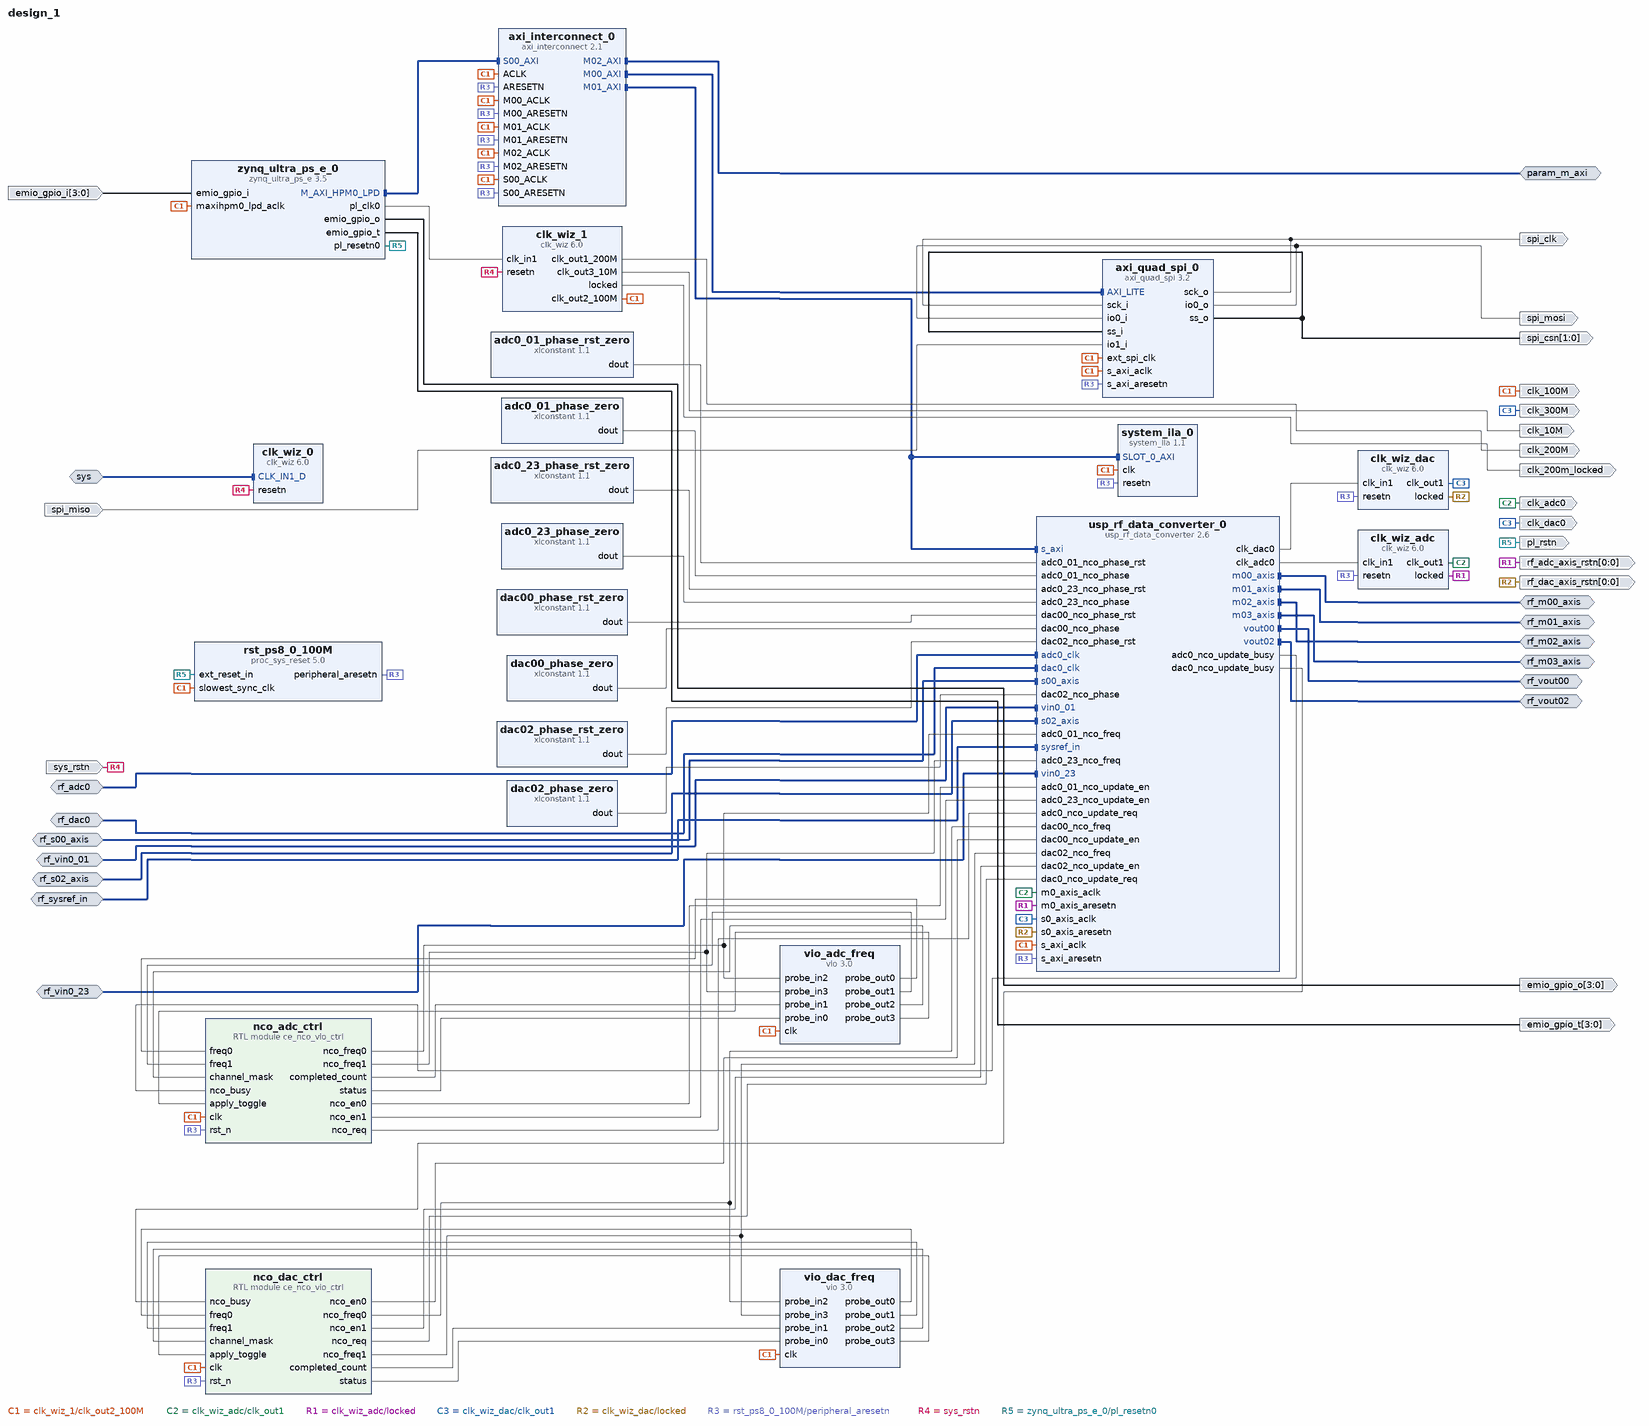
[diagram p0: block diagram of the top level]
# Vivado block design design_1, xczu47dr-ffve1156-2-i, Vivado 2023.2
create_bd_design design_1

create_bd_intf_port -mode Slave -vlnv xilinx.com:interface:diff_clock_rtl:1.0 sys
set_property -dict {CONFIG.FREQ_HZ 200000000} [get_bd_intf_ports sys]
create_bd_intf_port -mode Slave -vlnv xilinx.com:interface:diff_clock_rtl:1.0 rf_adc0
create_bd_intf_port -mode Slave -vlnv xilinx.com:interface:diff_analog_io_rtl:1.0 rf_vin0_01
create_bd_intf_port -mode Slave -vlnv xilinx.com:interface:diff_clock_rtl:1.0 rf_dac0
create_bd_intf_port -mode Slave -vlnv xilinx.com:display_usp_rf_data_converter:diff_pins_rtl:1.0 rf_sysref_in
create_bd_intf_port -mode Master -vlnv xilinx.com:interface:diff_analog_io_rtl:1.0 rf_vout00
create_bd_intf_port -mode Slave -vlnv xilinx.com:interface:axis_rtl:1.0 rf_s00_axis
set_property -dict [list \
  CONFIG.HAS_TKEEP 0 \
  CONFIG.HAS_TLAST 0 \
  CONFIG.HAS_TREADY 1 \
  CONFIG.HAS_TSTRB 0 \
  CONFIG.LAYERED_METADATA undef \
  CONFIG.TDATA_NUM_BYTES 32 \
  CONFIG.TDEST_WIDTH 0 \
  CONFIG.TID_WIDTH 0 \
  CONFIG.TUSER_WIDTH 0 \
] [get_bd_intf_ports rf_s00_axis]
create_bd_intf_port -mode Master -vlnv xilinx.com:interface:axis_rtl:1.0 rf_m00_axis
create_bd_intf_port -mode Master -vlnv xilinx.com:interface:axis_rtl:1.0 rf_m01_axis
create_bd_intf_port -mode Master -vlnv xilinx.com:interface:aximm_rtl:1.0 param_m_axi
set_property -dict [list \
  CONFIG.ADDR_WIDTH 40 \
  CONFIG.DATA_WIDTH 32 \
  CONFIG.HAS_REGION 0 \
  CONFIG.NUM_READ_OUTSTANDING 8 \
  CONFIG.NUM_WRITE_OUTSTANDING 8 \
  CONFIG.PROTOCOL AXI4LITE \
] [get_bd_intf_ports param_m_axi]
create_bd_intf_port -mode Master -vlnv xilinx.com:interface:diff_analog_io_rtl:1.0 rf_vout02
create_bd_intf_port -mode Slave -vlnv xilinx.com:interface:axis_rtl:1.0 rf_s02_axis
set_property -dict [list \
  CONFIG.HAS_TKEEP 0 \
  CONFIG.HAS_TLAST 0 \
  CONFIG.HAS_TREADY 1 \
  CONFIG.HAS_TSTRB 0 \
  CONFIG.LAYERED_METADATA undef \
  CONFIG.TDATA_NUM_BYTES 32 \
  CONFIG.TDEST_WIDTH 0 \
  CONFIG.TID_WIDTH 0 \
  CONFIG.TUSER_WIDTH 0 \
] [get_bd_intf_ports rf_s02_axis]
create_bd_intf_port -mode Master -vlnv xilinx.com:interface:axis_rtl:1.0 rf_m02_axis
create_bd_intf_port -mode Master -vlnv xilinx.com:interface:axis_rtl:1.0 rf_m03_axis
create_bd_intf_port -mode Slave -vlnv xilinx.com:interface:diff_analog_io_rtl:1.0 rf_vin0_23
create_bd_port -dir I -from 3 -to 0 emio_gpio_i
create_bd_port -dir O -from 3 -to 0 emio_gpio_o
create_bd_port -dir O -from 3 -to 0 emio_gpio_t
create_bd_port -dir I -type rst sys_rstn
create_bd_port -dir O -from 0 -to 0 -type rst rf_adc_axis_rstn
create_bd_port -dir O -from 0 -to 0 -type rst rf_dac_axis_rstn
create_bd_port -dir O -type clk clk_adc0
set_property -dict {CONFIG.ASSOCIATED_BUSIF rf_m01_axis:rf_m00_axis:rf_m02_axis:rf_m03_axis} [get_bd_ports clk_adc0]
create_bd_port -dir O -type clk clk_dac0
set_property -dict {CONFIG.ASSOCIATED_BUSIF rf_s00_axis:rf_s02_axis} [get_bd_ports clk_dac0]
create_bd_port -dir O -type clk clk_200M
create_bd_port -dir O -type clk clk_300M
set_property -dict {CONFIG.FREQ_HZ 300000000} [get_bd_ports clk_300M]
create_bd_port -dir O -type clk clk_100M
set_property -dict {CONFIG.ASSOCIATED_BUSIF param_m_axi CONFIG.ASSOCIATED_RESET clk_100M_rstn} [get_bd_ports clk_100M]
create_bd_port -dir O -type rst pl_rstn
create_bd_port -dir O -from 1 -to 0 spi_csn
create_bd_port -dir O spi_clk
create_bd_port -dir O spi_mosi
create_bd_port -dir I spi_miso
create_bd_port -dir O -type clk clk_10M
create_bd_port -dir O -type rst clk_200m_locked
set_property -dict {CONFIG.POLARITY ACTIVE_HIGH} [get_bd_ports clk_200m_locked]

create_bd_cell -type ip -vlnv xilinx.com:ip:zynq_ultra_ps_e:3.5 zynq_ultra_ps_e_0
set_property -dict [list \
  CONFIG.CAN0_BOARD_INTERFACE custom \
  CONFIG.CAN1_BOARD_INTERFACE custom \
  CONFIG.CSU_BOARD_INTERFACE custom \
  CONFIG.DP_BOARD_INTERFACE custom \
  CONFIG.GEM0_BOARD_INTERFACE custom \
  CONFIG.GEM1_BOARD_INTERFACE custom \
  CONFIG.GEM2_BOARD_INTERFACE custom \
  CONFIG.GEM3_BOARD_INTERFACE custom \
  CONFIG.GPIO_BOARD_INTERFACE custom \
  CONFIG.IIC0_BOARD_INTERFACE custom \
  CONFIG.IIC1_BOARD_INTERFACE custom \
  CONFIG.NAND_BOARD_INTERFACE custom \
  CONFIG.PCIE_BOARD_INTERFACE custom \
  CONFIG.PJTAG_BOARD_INTERFACE custom \
  CONFIG.PMU_BOARD_INTERFACE custom \
  CONFIG.PSU_BANK_0_IO_STANDARD LVCMOS18 \
  CONFIG.PSU_BANK_1_IO_STANDARD LVCMOS18 \
  CONFIG.PSU_BANK_2_IO_STANDARD LVCMOS18 \
  CONFIG.PSU_BANK_3_IO_STANDARD LVCMOS33 \
  CONFIG.PSU_USB3__DUAL_CLOCK_ENABLE 1 \
  CONFIG.PSU__CAN1__PERIPHERAL__ENABLE 0 \
  CONFIG.PSU__CRF_APB__ACPU_CTRL__FREQMHZ 1333.333 \
  CONFIG.PSU__CRF_APB__ACPU_CTRL__SRCSEL APLL \
  CONFIG.PSU__CRF_APB__APLL_CTRL__SRCSEL PSS_REF_CLK \
  CONFIG.PSU__CRF_APB__DBG_FPD_CTRL__FREQMHZ 250 \
  CONFIG.PSU__CRF_APB__DBG_FPD_CTRL__SRCSEL IOPLL \
  CONFIG.PSU__CRF_APB__DBG_TRACE_CTRL__FREQMHZ 250 \
  CONFIG.PSU__CRF_APB__DBG_TRACE_CTRL__SRCSEL IOPLL \
  CONFIG.PSU__CRF_APB__DBG_TSTMP_CTRL__FREQMHZ 250 \
  CONFIG.PSU__CRF_APB__DBG_TSTMP_CTRL__SRCSEL IOPLL \
  CONFIG.PSU__CRF_APB__DDR_CTRL__FREQMHZ 1200 \
  CONFIG.PSU__CRF_APB__DDR_CTRL__SRCSEL DPLL \
  CONFIG.PSU__CRF_APB__DPDMA_REF_CTRL__FREQMHZ 600 \
  CONFIG.PSU__CRF_APB__DPDMA_REF_CTRL__SRCSEL APLL \
  CONFIG.PSU__CRF_APB__DPLL_CTRL__SRCSEL PSS_REF_CLK \
  CONFIG.PSU__CRF_APB__DP_AUDIO_REF_CTRL__SRCSEL VPLL \
  CONFIG.PSU__CRF_APB__DP_STC_REF_CTRL__SRCSEL VPLL \
  CONFIG.PSU__CRF_APB__DP_VIDEO_REF_CTRL__SRCSEL VPLL \
  CONFIG.PSU__CRF_APB__GDMA_REF_CTRL__FREQMHZ 600 \
  CONFIG.PSU__CRF_APB__GDMA_REF_CTRL__SRCSEL APLL \
  CONFIG.PSU__CRF_APB__GPU_REF_CTRL__FREQMHZ 600 \
  CONFIG.PSU__CRF_APB__GPU_REF_CTRL__SRCSEL DPLL \
  CONFIG.PSU__CRF_APB__TOPSW_LSBUS_CTRL__FREQMHZ 100 \
  CONFIG.PSU__CRF_APB__TOPSW_LSBUS_CTRL__SRCSEL IOPLL \
  CONFIG.PSU__CRF_APB__TOPSW_MAIN_CTRL__FREQMHZ 533.333 \
  CONFIG.PSU__CRF_APB__TOPSW_MAIN_CTRL__SRCSEL DPLL \
  CONFIG.PSU__CRF_APB__VPLL_CTRL__SRCSEL PSS_REF_CLK \
  CONFIG.PSU__CRL_APB__ADMA_REF_CTRL__FREQMHZ 533.333 \
  CONFIG.PSU__CRL_APB__ADMA_REF_CTRL__SRCSEL IOPLL \
  CONFIG.PSU__CRL_APB__CAN1_REF_CTRL__FREQMHZ 100 \
  CONFIG.PSU__CRL_APB__CAN1_REF_CTRL__SRCSEL IOPLL \
  CONFIG.PSU__CRL_APB__CPU_R5_CTRL__FREQMHZ 500 \
  CONFIG.PSU__CRL_APB__CPU_R5_CTRL__SRCSEL IOPLL \
  CONFIG.PSU__CRL_APB__DBG_LPD_CTRL__FREQMHZ 250 \
  CONFIG.PSU__CRL_APB__DBG_LPD_CTRL__SRCSEL IOPLL \
  CONFIG.PSU__CRL_APB__GEM3_REF_CTRL__FREQMHZ 125 \
  CONFIG.PSU__CRL_APB__GEM3_REF_CTRL__SRCSEL IOPLL \
  CONFIG.PSU__CRL_APB__I2C0_REF_CTRL__FREQMHZ 100 \
  CONFIG.PSU__CRL_APB__I2C0_REF_CTRL__SRCSEL IOPLL \
  CONFIG.PSU__CRL_APB__I2C1_REF_CTRL__FREQMHZ 100 \
  CONFIG.PSU__CRL_APB__I2C1_REF_CTRL__SRCSEL IOPLL \
  CONFIG.PSU__CRL_APB__IOPLL_CTRL__SRCSEL PSS_REF_CLK \
  CONFIG.PSU__CRL_APB__IOU_SWITCH_CTRL__FREQMHZ 267 \
  CONFIG.PSU__CRL_APB__IOU_SWITCH_CTRL__SRCSEL IOPLL \
  CONFIG.PSU__CRL_APB__LPD_LSBUS_CTRL__FREQMHZ 100 \
  CONFIG.PSU__CRL_APB__LPD_LSBUS_CTRL__SRCSEL IOPLL \
  CONFIG.PSU__CRL_APB__LPD_SWITCH_CTRL__FREQMHZ 533.333 \
  CONFIG.PSU__CRL_APB__LPD_SWITCH_CTRL__SRCSEL IOPLL \
  CONFIG.PSU__CRL_APB__PCAP_CTRL__FREQMHZ 200 \
  CONFIG.PSU__CRL_APB__PCAP_CTRL__SRCSEL IOPLL \
  CONFIG.PSU__CRL_APB__PL0_REF_CTRL__FREQMHZ 100 \
  CONFIG.PSU__CRL_APB__PL0_REF_CTRL__SRCSEL IOPLL \
  CONFIG.PSU__CRL_APB__QSPI_REF_CTRL__FREQMHZ 300 \
  CONFIG.PSU__CRL_APB__QSPI_REF_CTRL__SRCSEL IOPLL \
  CONFIG.PSU__CRL_APB__RPLL_CTRL__SRCSEL PSS_REF_CLK \
  CONFIG.PSU__CRL_APB__SDIO1_REF_CTRL__FREQMHZ 200 \
  CONFIG.PSU__CRL_APB__SDIO1_REF_CTRL__SRCSEL RPLL \
  CONFIG.PSU__CRL_APB__TIMESTAMP_REF_CTRL__FREQMHZ 100 \
  CONFIG.PSU__CRL_APB__TIMESTAMP_REF_CTRL__SRCSEL IOPLL \
  CONFIG.PSU__CRL_APB__UART0_REF_CTRL__FREQMHZ 100 \
  CONFIG.PSU__CRL_APB__UART0_REF_CTRL__SRCSEL IOPLL \
  CONFIG.PSU__CRL_APB__UART1_REF_CTRL__FREQMHZ 100 \
  CONFIG.PSU__CRL_APB__UART1_REF_CTRL__SRCSEL IOPLL \
  CONFIG.PSU__CRL_APB__USB0_BUS_REF_CTRL__FREQMHZ 250 \
  CONFIG.PSU__CRL_APB__USB0_BUS_REF_CTRL__SRCSEL IOPLL \
  CONFIG.PSU__CRL_APB__USB3_DUAL_REF_CTRL__FREQMHZ 20 \
  CONFIG.PSU__CRL_APB__USB3_DUAL_REF_CTRL__SRCSEL IOPLL \
  CONFIG.PSU__CRL_APB__USB3__ENABLE 1 \
  CONFIG.PSU__CSUPMU__PERIPHERAL__VALID 0 \
  CONFIG.PSU__DDRC__BUS_WIDTH {64 Bit} \
  CONFIG.PSU__DDRC__COMPONENTS Components \
  CONFIG.PSU__DDRC__DEVICE_CAPACITY {4096 MBits} \
  CONFIG.PSU__DDRC__DRAM_WIDTH {16 Bits} \
  CONFIG.PSU__DDRC__ECC Disabled \
  CONFIG.PSU__DDRC__MEMORY_TYPE {DDR 4} \
  CONFIG.PSU__DDRC__SPEED_BIN DDR4_2400P \
  CONFIG.PSU__DDR_HIGH_ADDRESS_GUI_ENABLE 0 \
  CONFIG.PSU__DDR__INTERFACE__FREQMHZ 600.000 \
  CONFIG.PSU__DEVICE_TYPE RFSOC \
  CONFIG.PSU__DISPLAYPORT__LANE0__ENABLE 1 \
  CONFIG.PSU__DISPLAYPORT__LANE0__IO {GT Lane3} \
  CONFIG.PSU__DISPLAYPORT__LANE1__ENABLE 1 \
  CONFIG.PSU__DISPLAYPORT__LANE1__IO {GT Lane2} \
  CONFIG.PSU__DISPLAYPORT__PERIPHERAL__ENABLE 1 \
  CONFIG.PSU__DLL__ISUSED 1 \
  CONFIG.PSU__DPAUX__PERIPHERAL__ENABLE 1 \
  CONFIG.PSU__DPAUX__PERIPHERAL__IO {MIO 27 .. 30} \
  CONFIG.PSU__DP__LANE_SEL {Dual Higher} \
  CONFIG.PSU__DP__REF_CLK_FREQ 27 \
  CONFIG.PSU__DP__REF_CLK_SEL {Ref Clk2} \
  CONFIG.PSU__ENET3__FIFO__ENABLE 0 \
  CONFIG.PSU__ENET3__GRP_MDIO__ENABLE 1 \
  CONFIG.PSU__ENET3__GRP_MDIO__IO {MIO 76 .. 77} \
  CONFIG.PSU__ENET3__PERIPHERAL__ENABLE 1 \
  CONFIG.PSU__ENET3__PERIPHERAL__IO {MIO 64 .. 75} \
  CONFIG.PSU__ENET3__PTP__ENABLE 0 \
  CONFIG.PSU__ENET3__TSU__ENABLE 0 \
  CONFIG.PSU__FPD_SLCR__WDT1__FREQMHZ 100 \
  CONFIG.PSU__FPGA_PL0_ENABLE 1 \
  CONFIG.PSU__GEM3_COHERENCY 0 \
  CONFIG.PSU__GEM3_ROUTE_THROUGH_FPD 0 \
  CONFIG.PSU__GEM__TSU__ENABLE 0 \
  CONFIG.PSU__GPIO0_MIO__PERIPHERAL__ENABLE 0 \
  CONFIG.PSU__GPIO1_MIO__PERIPHERAL__ENABLE 0 \
  CONFIG.PSU__GPIO_EMIO_WIDTH 4 \
  CONFIG.PSU__GPIO_EMIO__PERIPHERAL__ENABLE 1 \
  CONFIG.PSU__GPIO_EMIO__PERIPHERAL__IO 4 \
  CONFIG.PSU__GPU_PP0__POWER__ON 0 \
  CONFIG.PSU__GPU_PP1__POWER__ON 0 \
  CONFIG.PSU__GT__LINK_SPEED HBR \
  CONFIG.PSU__GT__PRE_EMPH_LVL_4 0 \
  CONFIG.PSU__GT__VLT_SWNG_LVL_4 0 \
  CONFIG.PSU__I2C0__PERIPHERAL__ENABLE 0 \
  CONFIG.PSU__I2C1__PERIPHERAL__ENABLE 1 \
  CONFIG.PSU__I2C1__PERIPHERAL__IO {MIO 24 .. 25} \
  CONFIG.PSU__IOU_SLCR__IOU_TTC_APB_CLK__TTC0_SEL APB \
  CONFIG.PSU__IOU_SLCR__IOU_TTC_APB_CLK__TTC1_SEL APB \
  CONFIG.PSU__IOU_SLCR__IOU_TTC_APB_CLK__TTC2_SEL APB \
  CONFIG.PSU__IOU_SLCR__IOU_TTC_APB_CLK__TTC3_SEL APB \
  CONFIG.PSU__IOU_SLCR__TTC0__FREQMHZ 100 \
  CONFIG.PSU__IOU_SLCR__TTC1__FREQMHZ 100 \
  CONFIG.PSU__IOU_SLCR__TTC2__FREQMHZ 100 \
  CONFIG.PSU__IOU_SLCR__TTC3__FREQMHZ 100 \
  CONFIG.PSU__IOU_SLCR__WDT0__FREQMHZ 100 \
  CONFIG.PSU__LPD_SLCR__CSUPMU__FREQMHZ 100 \
  CONFIG.PSU__OVERRIDE_HPX_QOS 0 \
  CONFIG.PSU__OVERRIDE__BASIC_CLOCK 0 \
  CONFIG.PSU__PMU__PERIPHERAL__ENABLE 0 \
  CONFIG.PSU__PRESET_APPLIED 0 \
  CONFIG.PSU__PSS_REF_CLK__FREQMHZ 33.333333 \
  CONFIG.PSU__QSPI_COHERENCY 0 \
  CONFIG.PSU__QSPI_ROUTE_THROUGH_FPD 0 \
  CONFIG.PSU__QSPI__GRP_FBCLK__ENABLE 0 \
  CONFIG.PSU__QSPI__PERIPHERAL__DATA_MODE x4 \
  CONFIG.PSU__QSPI__PERIPHERAL__ENABLE 1 \
  CONFIG.PSU__QSPI__PERIPHERAL__IO {MIO 0 .. 12} \
  CONFIG.PSU__QSPI__PERIPHERAL__MODE {Dual Parallel} \
  CONFIG.PSU__SATA__LANE0__ENABLE 1 \
  CONFIG.PSU__SATA__LANE0__IO {GT Lane0} \
  CONFIG.PSU__SATA__LANE1__ENABLE 0 \
  CONFIG.PSU__SATA__PERIPHERAL__ENABLE 1 \
  CONFIG.PSU__SATA__REF_CLK_FREQ 150 \
  CONFIG.PSU__SATA__REF_CLK_SEL {Ref Clk0} \
  CONFIG.PSU__SD0__CLK_200_SDR_OTAP_DLY 0x3 \
  CONFIG.PSU__SD0__CLK_50_DDR_ITAP_DLY 0x12 \
  CONFIG.PSU__SD0__CLK_50_DDR_OTAP_DLY 0x6 \
  CONFIG.PSU__SD0__CLK_50_SDR_ITAP_DLY 0x15 \
  CONFIG.PSU__SD0__CLK_50_SDR_OTAP_DLY 0x6 \
  CONFIG.PSU__SD0__DATA_TRANSFER_MODE 8Bit \
  CONFIG.PSU__SD0__GRP_POW__ENABLE 1 \
  CONFIG.PSU__SD0__GRP_POW__IO {MIO 23} \
  CONFIG.PSU__SD0__PERIPHERAL__ENABLE 1 \
  CONFIG.PSU__SD0__PERIPHERAL__IO {MIO 13 .. 22} \
  CONFIG.PSU__SD0__RESET__ENABLE 1 \
  CONFIG.PSU__SD0__SLOT_TYPE eMMC \
  CONFIG.PSU__SD1_COHERENCY 0 \
  CONFIG.PSU__SD1_ROUTE_THROUGH_FPD 0 \
  CONFIG.PSU__SD1__CLK_50_SDR_ITAP_DLY 0x15 \
  CONFIG.PSU__SD1__CLK_50_SDR_OTAP_DLY 0x5 \
  CONFIG.PSU__SD1__DATA_TRANSFER_MODE 4Bit \
  CONFIG.PSU__SD1__GRP_CD__ENABLE 1 \
  CONFIG.PSU__SD1__GRP_CD__IO {MIO 45} \
  CONFIG.PSU__SD1__GRP_POW__ENABLE 0 \
  CONFIG.PSU__SD1__GRP_WP__ENABLE 0 \
  CONFIG.PSU__SD1__PERIPHERAL__ENABLE 1 \
  CONFIG.PSU__SD1__PERIPHERAL__IO {MIO 46 .. 51} \
  CONFIG.PSU__SD1__SLOT_TYPE {SD 2.0} \
  CONFIG.PSU__SWDT0__PERIPHERAL__ENABLE 0 \
  CONFIG.PSU__SWDT1__PERIPHERAL__ENABLE 0 \
  CONFIG.PSU__TSU__BUFG_PORT_PAIR 0 \
  CONFIG.PSU__TTC0__PERIPHERAL__ENABLE 0 \
  CONFIG.PSU__TTC1__PERIPHERAL__ENABLE 0 \
  CONFIG.PSU__TTC2__PERIPHERAL__ENABLE 0 \
  CONFIG.PSU__TTC3__PERIPHERAL__ENABLE 0 \
  CONFIG.PSU__UART0__BAUD_RATE 115200 \
  CONFIG.PSU__UART0__MODEM__ENABLE 0 \
  CONFIG.PSU__UART0__PERIPHERAL__ENABLE 1 \
  CONFIG.PSU__UART0__PERIPHERAL__IO {MIO 42 .. 43} \
  CONFIG.PSU__UART1__BAUD_RATE 115200 \
  CONFIG.PSU__UART1__MODEM__ENABLE 0 \
  CONFIG.PSU__UART1__PERIPHERAL__ENABLE 1 \
  CONFIG.PSU__UART1__PERIPHERAL__IO {MIO 40 .. 41} \
  CONFIG.PSU__USB0_COHERENCY 0 \
  CONFIG.PSU__USB0__PERIPHERAL__ENABLE 1 \
  CONFIG.PSU__USB0__PERIPHERAL__IO {MIO 52 .. 63} \
  CONFIG.PSU__USB0__REF_CLK_FREQ 26 \
  CONFIG.PSU__USB0__REF_CLK_SEL {Ref Clk1} \
  CONFIG.PSU__USB0__RESET__ENABLE 1 \
  CONFIG.PSU__USB0__RESET__IO {MIO 32} \
  CONFIG.PSU__USB2_0__EMIO__ENABLE 0 \
  CONFIG.PSU__USB3_0__EMIO__ENABLE 0 \
  CONFIG.PSU__USB3_0__PERIPHERAL__ENABLE 1 \
  CONFIG.PSU__USB3_0__PERIPHERAL__IO {GT Lane1} \
  CONFIG.PSU__USB__RESET__MODE {Separate MIO Pin} \
  CONFIG.PSU__USB__RESET__POLARITY {Active Low} \
  CONFIG.PSU__USE__IRQ0 0 \
  CONFIG.PSU__USE__M_AXI_GP0 0 \
  CONFIG.PSU__USE__M_AXI_GP1 0 \
  CONFIG.PSU__USE__M_AXI_GP2 1 \
  CONFIG.QSPI_BOARD_INTERFACE custom \
  CONFIG.SATA_BOARD_INTERFACE custom \
  CONFIG.SD0_BOARD_INTERFACE custom \
  CONFIG.SD1_BOARD_INTERFACE custom \
  CONFIG.SPI0_BOARD_INTERFACE custom \
  CONFIG.SPI1_BOARD_INTERFACE custom \
  CONFIG.SUBPRESET1 DDR4_MICRON_MT40A256M16GE_083E \
  CONFIG.SUBPRESET2 Custom \
  CONFIG.SWDT0_BOARD_INTERFACE custom \
  CONFIG.SWDT1_BOARD_INTERFACE custom \
  CONFIG.TRACE_BOARD_INTERFACE custom \
  CONFIG.TTC0_BOARD_INTERFACE custom \
  CONFIG.TTC1_BOARD_INTERFACE custom \
  CONFIG.TTC2_BOARD_INTERFACE custom \
  CONFIG.TTC3_BOARD_INTERFACE custom \
  CONFIG.UART0_BOARD_INTERFACE custom \
  CONFIG.UART1_BOARD_INTERFACE custom \
  CONFIG.USB0_BOARD_INTERFACE custom \
  CONFIG.USB1_BOARD_INTERFACE custom \
  CONFIG.preset None \
] [get_bd_cells zynq_ultra_ps_e_0]
# 712 more settings of zynq_ultra_ps_e_0 are not shown: defaults, MIO pin electricals, DDR timing, and values the tool derives
create_bd_cell -type ip -vlnv xilinx.com:ip:proc_sys_reset:5.0 rst_ps8_0_100M
create_bd_cell -type ip -vlnv xilinx.com:ip:clk_wiz:6.0 clk_wiz_0
set_property -dict [list \
  CONFIG.CLKIN1_JITTER_PS 50.0 \
  CONFIG.CLKOUT1_JITTER 92.799 \
  CONFIG.CLKOUT1_PHASE_ERROR 82.655 \
  CONFIG.CLKOUT1_REQUESTED_OUT_FREQ 200.000 \
  CONFIG.CLKOUT2_JITTER 106.024 \
  CONFIG.CLKOUT2_PHASE_ERROR 82.655 \
  CONFIG.CLKOUT2_REQUESTED_OUT_FREQ 100.000 \
  CONFIG.CLKOUT2_USED true \
  CONFIG.CLKOUT3_JITTER 167.577 \
  CONFIG.CLKOUT3_PHASE_ERROR 82.655 \
  CONFIG.CLKOUT3_REQUESTED_OUT_FREQ 10.000 \
  CONFIG.CLKOUT3_USED true \
  CONFIG.CLK_OUT1_PORT clk_out1_200M \
  CONFIG.CLK_OUT2_PORT clk_out2_100M \
  CONFIG.CLK_OUT3_PORT clk_out3_10M \
  CONFIG.MMCM_CLKFBOUT_MULT_F 6.000 \
  CONFIG.MMCM_CLKIN1_PERIOD 5.000 \
  CONFIG.MMCM_CLKIN2_PERIOD 10.0 \
  CONFIG.MMCM_CLKOUT0_DIVIDE_F 6.000 \
  CONFIG.MMCM_CLKOUT1_DIVIDE 12 \
  CONFIG.MMCM_CLKOUT2_DIVIDE 120 \
  CONFIG.NUM_OUT_CLKS 3 \
  CONFIG.OPTIMIZE_CLOCKING_STRUCTURE_EN true \
  CONFIG.PRIM_IN_FREQ 200.000 \
  CONFIG.PRIM_SOURCE Differential_clock_capable_pin \
  CONFIG.RESET_PORT resetn \
  CONFIG.RESET_TYPE ACTIVE_LOW \
] [get_bd_cells clk_wiz_0]
create_bd_cell -type ip -vlnv xilinx.com:ip:usp_rf_data_converter:2.6 usp_rf_data_converter_0
set_property -dict [list \
  CONFIG.ADC0_Multi_Tile_Sync false \
  CONFIG.ADC0_Outclk_Freq 300.000 \
  CONFIG.ADC0_PLL_Enable true \
  CONFIG.ADC0_Refclk_Freq 300.000 \
  CONFIG.ADC0_Sampling_Rate 4.8 \
  CONFIG.ADC224_En true \
  CONFIG.ADC227_En false \
  CONFIG.ADC_CalOpt_Mode00 2 \
  CONFIG.ADC_CalOpt_Mode02 2 \
  CONFIG.ADC_DSA_RTS false \
  CONFIG.ADC_Data_Type00 1 \
  CONFIG.ADC_Data_Type02 1 \
  CONFIG.ADC_Decimation_Mode00 2 \
  CONFIG.ADC_Decimation_Mode02 2 \
  CONFIG.ADC_Mixer_Mode00 0 \
  CONFIG.ADC_Mixer_Type00 2 \
  CONFIG.ADC_Mixer_Type02 2 \
  CONFIG.ADC_NCO_Freq00 1.2 \
  CONFIG.ADC_NCO_Freq02 -1.2 \
  CONFIG.ADC_NCO_RTS true \
  CONFIG.ADC_Nyquist00 0 \
  CONFIG.ADC_Nyquist02 1 \
  CONFIG.ADC_RTS false \
  CONFIG.ADC_Slice02_Enable true \
  CONFIG.Axiclk_Freq 100 \
  CONFIG.Calibration_Freeze false \
  CONFIG.Converter_Setup 1 \
  CONFIG.DAC0_Multi_Tile_Sync false \
  CONFIG.DAC0_Outclk_Freq 300.000 \
  CONFIG.DAC0_PLL_Enable true \
  CONFIG.DAC0_Refclk_Freq 300.000 \
  CONFIG.DAC0_Sampling_Rate 4.8 \
  CONFIG.DAC0_VOP 36 \
  CONFIG.DAC228_En true \
  CONFIG.DAC_Data_Width00 16 \
  CONFIG.DAC_Interpolation_Mode00 2 \
  CONFIG.DAC_Interpolation_Mode02 2 \
  CONFIG.DAC_Mixer_Mode00 0 \
  CONFIG.DAC_Mixer_Mode02 0 \
  CONFIG.DAC_Mixer_Type00 2 \
  CONFIG.DAC_Mixer_Type02 2 \
  CONFIG.DAC_NCO_Freq00 -1.2 \
  CONFIG.DAC_NCO_Freq02 1.2 \
  CONFIG.DAC_NCO_RTS true \
  CONFIG.DAC_Nyquist00 0 \
  CONFIG.DAC_Nyquist02 1 \
  CONFIG.DAC_RTS false \
  CONFIG.DAC_Slice00_Enable true \
  CONFIG.DAC_Slice02_Enable true \
  CONFIG.DAC_Slice20_Enable false \
  CONFIG.DAC_VOP_Mode 1 \
  CONFIG.DAC_VOP_RTS false \
  CONFIG.RF_Analyzer 1 \
  CONFIG.mDAC_Coarse_Mixer_Freq00 3 \
  CONFIG.mDAC_Data_Width00 8 \
  CONFIG.mDAC_Interpolation_Mode00 1 \
  CONFIG.mDAC_Mixer_Type00 1 \
  CONFIG.mDAC_Outclk_Freq 125.000 \
  CONFIG.mDAC_PLL_Enable true \
  CONFIG.mDAC_Refclk_Freq 125.000 \
  CONFIG.mDAC_Sampling_Rate 2 \
  CONFIG.mDAC_Slice00_Enable true \
] [get_bd_cells usp_rf_data_converter_0]
create_bd_cell -type ip -vlnv xilinx.com:ip:clk_wiz:6.0 clk_wiz_1
set_property -dict [list \
  CONFIG.CLKIN1_JITTER_PS 100.0 \
  CONFIG.CLKOUT1_JITTER 102.086 \
  CONFIG.CLKOUT1_PHASE_ERROR 87.180 \
  CONFIG.CLKOUT1_REQUESTED_OUT_FREQ 200.000 \
  CONFIG.CLKOUT2_JITTER 115.831 \
  CONFIG.CLKOUT2_PHASE_ERROR 87.180 \
  CONFIG.CLKOUT2_USED true \
  CONFIG.CLKOUT3_JITTER 188.586 \
  CONFIG.CLKOUT3_PHASE_ERROR 87.180 \
  CONFIG.CLKOUT3_REQUESTED_OUT_FREQ 10.000 \
  CONFIG.CLKOUT3_USED true \
  CONFIG.CLKOUT4_JITTER 107.567 \
  CONFIG.CLKOUT4_PHASE_ERROR 87.180 \
  CONFIG.CLKOUT4_REQUESTED_OUT_FREQ 150.000 \
  CONFIG.CLKOUT4_USED false \
  CONFIG.CLK_OUT1_PORT clk_out1_200M \
  CONFIG.CLK_OUT2_PORT clk_out2_100M \
  CONFIG.CLK_OUT3_PORT clk_out3_10M \
  CONFIG.CLK_OUT4_PORT clk_out4_300M \
  CONFIG.MMCM_CLKFBOUT_MULT_F 12.000 \
  CONFIG.MMCM_CLKIN1_PERIOD 10.000 \
  CONFIG.MMCM_CLKIN2_PERIOD 10.000 \
  CONFIG.MMCM_CLKOUT0_DIVIDE_F 6.000 \
  CONFIG.MMCM_CLKOUT1_DIVIDE 12 \
  CONFIG.MMCM_CLKOUT2_DIVIDE 120 \
  CONFIG.MMCM_CLKOUT3_DIVIDE 1 \
  CONFIG.MMCM_DIVCLK_DIVIDE 1 \
  CONFIG.NUM_OUT_CLKS 3 \
  CONFIG.PRIM_IN_FREQ 100.000 \
  CONFIG.PRIM_SOURCE No_buffer \
  CONFIG.RESET_PORT resetn \
  CONFIG.RESET_TYPE ACTIVE_LOW \
] [get_bd_cells clk_wiz_1]
create_bd_cell -type ip -vlnv xilinx.com:ip:clk_wiz:6.0 clk_wiz_adc
set_property -dict [list \
  CONFIG.CLKIN1_JITTER_PS 33.330000000000005 \
  CONFIG.CLKOUT1_JITTER 81.814 \
  CONFIG.CLKOUT1_PHASE_ERROR 77.836 \
  CONFIG.CLKOUT1_REQUESTED_OUT_FREQ 300 \
  CONFIG.CLKOUT2_JITTER 175.205 \
  CONFIG.CLKOUT2_PHASE_ERROR 85.475 \
  CONFIG.CLKOUT2_REQUESTED_OUT_FREQ 10.000 \
  CONFIG.CLKOUT2_USED false \
  CONFIG.MMCM_CLKFBOUT_MULT_F 4.000 \
  CONFIG.MMCM_CLKIN1_PERIOD 3.333 \
  CONFIG.MMCM_CLKIN2_PERIOD 10.0 \
  CONFIG.MMCM_CLKOUT0_DIVIDE_F 4.000 \
  CONFIG.MMCM_CLKOUT1_DIVIDE 1 \
  CONFIG.NUM_OUT_CLKS 1 \
  CONFIG.PRIM_IN_FREQ 300 \
  CONFIG.PRIM_SOURCE No_buffer \
  CONFIG.RESET_PORT resetn \
  CONFIG.RESET_TYPE ACTIVE_LOW \
] [get_bd_cells clk_wiz_adc]
create_bd_cell -type ip -vlnv xilinx.com:ip:clk_wiz:6.0 clk_wiz_dac
set_property -dict [list \
  CONFIG.CLKIN1_JITTER_PS 33.330000000000005 \
  CONFIG.CLKOUT1_JITTER 81.814 \
  CONFIG.CLKOUT1_PHASE_ERROR 77.836 \
  CONFIG.CLKOUT1_REQUESTED_OUT_FREQ 300 \
  CONFIG.MMCM_CLKFBOUT_MULT_F 4.000 \
  CONFIG.MMCM_CLKIN1_PERIOD 3.333 \
  CONFIG.MMCM_CLKIN2_PERIOD 10.0 \
  CONFIG.MMCM_CLKOUT0_DIVIDE_F 4.000 \
  CONFIG.PRIM_IN_FREQ 300 \
  CONFIG.PRIM_SOURCE No_buffer \
  CONFIG.RESET_PORT resetn \
  CONFIG.RESET_TYPE ACTIVE_LOW \
] [get_bd_cells clk_wiz_dac]
create_bd_cell -type ip -vlnv xilinx.com:ip:axi_quad_spi:3.2 axi_quad_spi_0
set_property -dict {CONFIG.C_NUM_SS_BITS 2} [get_bd_cells axi_quad_spi_0]
create_bd_cell -type ip -vlnv xilinx.com:ip:system_ila:1.1 system_ila_0
set_property -dict [list \
  CONFIG.C_MON_TYPE INTERFACE \
  CONFIG.C_NUM_MONITOR_SLOTS 1 \
  CONFIG.C_SLOT_0_APC_EN 0 \
  CONFIG.C_SLOT_0_AXI_AR_SEL_DATA 1 \
  CONFIG.C_SLOT_0_AXI_AR_SEL_TRIG 1 \
  CONFIG.C_SLOT_0_AXI_AW_SEL_DATA 1 \
  CONFIG.C_SLOT_0_AXI_AW_SEL_TRIG 1 \
  CONFIG.C_SLOT_0_AXI_B_SEL_DATA 1 \
  CONFIG.C_SLOT_0_AXI_B_SEL_TRIG 1 \
  CONFIG.C_SLOT_0_AXI_R_SEL_DATA 1 \
  CONFIG.C_SLOT_0_AXI_R_SEL_TRIG 1 \
  CONFIG.C_SLOT_0_AXI_W_SEL_DATA 1 \
  CONFIG.C_SLOT_0_AXI_W_SEL_TRIG 1 \
  CONFIG.C_SLOT_0_INTF_TYPE xilinx.com:interface:aximm_rtl:1.0 \
] [get_bd_cells system_ila_0]
create_bd_cell -type ip -vlnv xilinx.com:ip:axi_interconnect:2.1 axi_interconnect_0
set_property -dict {CONFIG.NUM_MI 3} [get_bd_cells axi_interconnect_0]
create_bd_cell -type module -reference ce_nco_vio_ctrl nco_adc_ctrl
set_property -dict {CONFIG.BUSY_WIDTH 1} [get_bd_cells nco_adc_ctrl]
create_bd_cell -type ip -vlnv xilinx.com:ip:vio:3.0 vio_adc_freq
set_property -dict [list \
  CONFIG.C_NUM_PROBE_IN 4 \
  CONFIG.C_NUM_PROBE_OUT 4 \
  CONFIG.C_PROBE_OUT0_INIT_VAL 0x400000000000 \
  CONFIG.C_PROBE_OUT0_WIDTH 48 \
  CONFIG.C_PROBE_OUT1_INIT_VAL 0xc00000000000 \
  CONFIG.C_PROBE_OUT1_WIDTH 48 \
  CONFIG.C_PROBE_OUT2_INIT_VAL 0x3 \
  CONFIG.C_PROBE_OUT2_WIDTH 2 \
  CONFIG.C_PROBE_OUT3_WIDTH 1 \
] [get_bd_cells vio_adc_freq]
create_bd_cell -type ip -vlnv xilinx.com:ip:xlconstant:1.1 adc0_01_phase_zero
set_property -dict {CONFIG.CONST_VAL 0 CONFIG.CONST_WIDTH 18} [get_bd_cells adc0_01_phase_zero]
create_bd_cell -type ip -vlnv xilinx.com:ip:xlconstant:1.1 adc0_01_phase_rst_zero
set_property -dict {CONFIG.CONST_VAL 0 CONFIG.CONST_WIDTH 1} [get_bd_cells adc0_01_phase_rst_zero]
create_bd_cell -type ip -vlnv xilinx.com:ip:xlconstant:1.1 adc0_23_phase_zero
set_property -dict {CONFIG.CONST_VAL 0 CONFIG.CONST_WIDTH 18} [get_bd_cells adc0_23_phase_zero]
create_bd_cell -type ip -vlnv xilinx.com:ip:xlconstant:1.1 adc0_23_phase_rst_zero
set_property -dict {CONFIG.CONST_VAL 0 CONFIG.CONST_WIDTH 1} [get_bd_cells adc0_23_phase_rst_zero]
create_bd_cell -type module -reference ce_nco_vio_ctrl nco_dac_ctrl
set_property -dict {CONFIG.BUSY_WIDTH 2} [get_bd_cells nco_dac_ctrl]
create_bd_cell -type ip -vlnv xilinx.com:ip:vio:3.0 vio_dac_freq
set_property -dict [list \
  CONFIG.C_NUM_PROBE_IN 4 \
  CONFIG.C_NUM_PROBE_OUT 4 \
  CONFIG.C_PROBE_OUT0_INIT_VAL 0xc00000000000 \
  CONFIG.C_PROBE_OUT0_WIDTH 48 \
  CONFIG.C_PROBE_OUT1_INIT_VAL 0x400000000000 \
  CONFIG.C_PROBE_OUT1_WIDTH 48 \
  CONFIG.C_PROBE_OUT2_INIT_VAL 0x3 \
  CONFIG.C_PROBE_OUT2_WIDTH 2 \
  CONFIG.C_PROBE_OUT3_WIDTH 1 \
] [get_bd_cells vio_dac_freq]
create_bd_cell -type ip -vlnv xilinx.com:ip:xlconstant:1.1 dac00_phase_zero
set_property -dict {CONFIG.CONST_VAL 0 CONFIG.CONST_WIDTH 18} [get_bd_cells dac00_phase_zero]
create_bd_cell -type ip -vlnv xilinx.com:ip:xlconstant:1.1 dac00_phase_rst_zero
set_property -dict {CONFIG.CONST_VAL 0 CONFIG.CONST_WIDTH 1} [get_bd_cells dac00_phase_rst_zero]
create_bd_cell -type ip -vlnv xilinx.com:ip:xlconstant:1.1 dac02_phase_zero
set_property -dict {CONFIG.CONST_VAL 0 CONFIG.CONST_WIDTH 18} [get_bd_cells dac02_phase_zero]
create_bd_cell -type ip -vlnv xilinx.com:ip:xlconstant:1.1 dac02_phase_rst_zero
set_property -dict {CONFIG.CONST_VAL 0 CONFIG.CONST_WIDTH 1} [get_bd_cells dac02_phase_rst_zero]

# ---- connections ----

connect_bd_intf_net -intf_net CLK_IN1_D_0_1 [get_bd_intf_ports sys] [get_bd_intf_pins clk_wiz_0/CLK_IN1_D]
connect_bd_intf_net [get_bd_intf_pins axi_interconnect_0/S00_AXI] [get_bd_intf_pins zynq_ultra_ps_e_0/M_AXI_HPM0_LPD]
connect_bd_intf_net [get_bd_intf_pins axi_interconnect_0/M00_AXI] [get_bd_intf_pins axi_quad_spi_0/AXI_LITE]
connect_bd_intf_net -intf_net axi_interconnect_0_M01_AXI [get_bd_intf_pins axi_interconnect_0/M01_AXI] [get_bd_intf_pins usp_rf_data_converter_0/s_axi]
connect_bd_intf_net [get_bd_intf_pins axi_interconnect_0/M01_AXI] [get_bd_intf_pins system_ila_0/SLOT_0_AXI]
connect_bd_intf_net [get_bd_intf_ports param_m_axi] [get_bd_intf_pins axi_interconnect_0/M02_AXI]
connect_bd_intf_net -intf_net rf_adc3_1 [get_bd_intf_ports rf_adc0] [get_bd_intf_pins usp_rf_data_converter_0/adc0_clk]
connect_bd_intf_net -intf_net rf_dac2_1 [get_bd_intf_ports rf_dac0] [get_bd_intf_pins usp_rf_data_converter_0/dac0_clk]
connect_bd_intf_net -intf_net rf_s20_axis_1 [get_bd_intf_ports rf_s00_axis] [get_bd_intf_pins usp_rf_data_converter_0/s00_axis]
connect_bd_intf_net -intf_net rf_vin3_01_1 [get_bd_intf_ports rf_vin0_01] [get_bd_intf_pins usp_rf_data_converter_0/vin0_01]
connect_bd_intf_net -intf_net s02_axis_0_1 [get_bd_intf_ports rf_s02_axis] [get_bd_intf_pins usp_rf_data_converter_0/s02_axis]
connect_bd_intf_net -intf_net sysref_in_0_1 [get_bd_intf_ports rf_sysref_in] [get_bd_intf_pins usp_rf_data_converter_0/sysref_in]
connect_bd_intf_net [get_bd_intf_ports rf_m00_axis] [get_bd_intf_pins usp_rf_data_converter_0/m00_axis]
connect_bd_intf_net [get_bd_intf_ports rf_m01_axis] [get_bd_intf_pins usp_rf_data_converter_0/m01_axis]
connect_bd_intf_net [get_bd_intf_ports rf_m02_axis] [get_bd_intf_pins usp_rf_data_converter_0/m02_axis]
connect_bd_intf_net [get_bd_intf_ports rf_m03_axis] [get_bd_intf_pins usp_rf_data_converter_0/m03_axis]
connect_bd_intf_net [get_bd_intf_ports rf_vout00] [get_bd_intf_pins usp_rf_data_converter_0/vout00]
connect_bd_intf_net [get_bd_intf_ports rf_vout02] [get_bd_intf_pins usp_rf_data_converter_0/vout02]
connect_bd_intf_net -intf_net vin0_23_0_1 [get_bd_intf_ports rf_vin0_23] [get_bd_intf_pins usp_rf_data_converter_0/vin0_23]
connect_bd_net [get_bd_pins adc0_01_phase_rst_zero/dout] [get_bd_pins usp_rf_data_converter_0/adc0_01_nco_phase_rst]
connect_bd_net [get_bd_pins adc0_01_phase_zero/dout] [get_bd_pins usp_rf_data_converter_0/adc0_01_nco_phase]
connect_bd_net [get_bd_pins adc0_23_phase_rst_zero/dout] [get_bd_pins usp_rf_data_converter_0/adc0_23_nco_phase_rst]
connect_bd_net [get_bd_pins adc0_23_phase_zero/dout] [get_bd_pins usp_rf_data_converter_0/adc0_23_nco_phase]
connect_bd_net [get_bd_pins axi_quad_spi_0/io0_o] [get_bd_ports spi_mosi] [get_bd_pins axi_quad_spi_0/io0_i]
connect_bd_net [get_bd_pins axi_quad_spi_0/sck_o] [get_bd_ports spi_clk] [get_bd_pins axi_quad_spi_0/sck_i]
connect_bd_net [get_bd_pins axi_quad_spi_0/ss_o] [get_bd_ports spi_csn] [get_bd_pins axi_quad_spi_0/ss_i]
connect_bd_net [get_bd_pins clk_wiz_1/clk_out1_200M] [get_bd_ports clk_200M]
connect_bd_net [get_bd_pins clk_wiz_1/clk_out2_100M] \
  [get_bd_ports clk_100M] [get_bd_pins axi_quad_spi_0/ext_spi_clk] [get_bd_pins axi_quad_spi_0/s_axi_aclk] \
  [get_bd_pins rst_ps8_0_100M/slowest_sync_clk] [get_bd_pins usp_rf_data_converter_0/s_axi_aclk] \
  [get_bd_pins zynq_ultra_ps_e_0/maxihpm0_lpd_aclk] [get_bd_pins system_ila_0/clk] [get_bd_pins axi_interconnect_0/ACLK] \
  [get_bd_pins axi_interconnect_0/S00_ACLK] [get_bd_pins axi_interconnect_0/M00_ACLK] \
  [get_bd_pins axi_interconnect_0/M01_ACLK] [get_bd_pins axi_interconnect_0/M02_ACLK] [get_bd_pins vio_adc_freq/clk] \
  [get_bd_pins vio_dac_freq/clk] [get_bd_pins nco_adc_ctrl/clk] [get_bd_pins nco_dac_ctrl/clk]
connect_bd_net [get_bd_pins clk_wiz_1/clk_out3_10M] [get_bd_ports clk_10M]
connect_bd_net [get_bd_pins clk_wiz_1/locked] [get_bd_ports clk_200m_locked]
connect_bd_net [get_bd_pins clk_wiz_adc/clk_out1] [get_bd_ports clk_adc0] [get_bd_pins usp_rf_data_converter_0/m0_axis_aclk]
connect_bd_net [get_bd_pins clk_wiz_adc/locked] [get_bd_ports rf_adc_axis_rstn] [get_bd_pins usp_rf_data_converter_0/m0_axis_aresetn]
connect_bd_net [get_bd_pins clk_wiz_dac/clk_out1] [get_bd_ports clk_dac0] [get_bd_pins usp_rf_data_converter_0/s0_axis_aclk] [get_bd_ports clk_300M]
connect_bd_net [get_bd_pins clk_wiz_dac/locked] [get_bd_ports rf_dac_axis_rstn] [get_bd_pins usp_rf_data_converter_0/s0_axis_aresetn]
connect_bd_net [get_bd_pins dac00_phase_rst_zero/dout] [get_bd_pins usp_rf_data_converter_0/dac00_nco_phase_rst]
connect_bd_net [get_bd_pins dac00_phase_zero/dout] [get_bd_pins usp_rf_data_converter_0/dac00_nco_phase]
connect_bd_net [get_bd_pins dac02_phase_rst_zero/dout] [get_bd_pins usp_rf_data_converter_0/dac02_nco_phase_rst]
connect_bd_net [get_bd_pins dac02_phase_zero/dout] [get_bd_pins usp_rf_data_converter_0/dac02_nco_phase]
connect_bd_net -net emio_gpio_i_0_1 [get_bd_ports emio_gpio_i] [get_bd_pins zynq_ultra_ps_e_0/emio_gpio_i]
connect_bd_net -net io1_i_0_1 [get_bd_ports spi_miso] [get_bd_pins axi_quad_spi_0/io1_i]
connect_bd_net [get_bd_pins nco_adc_ctrl/completed_count] [get_bd_pins vio_adc_freq/probe_in1]
connect_bd_net [get_bd_pins nco_adc_ctrl/nco_en0] [get_bd_pins usp_rf_data_converter_0/adc0_01_nco_update_en]
connect_bd_net [get_bd_pins nco_adc_ctrl/nco_en1] [get_bd_pins usp_rf_data_converter_0/adc0_23_nco_update_en]
connect_bd_net [get_bd_pins nco_adc_ctrl/nco_freq0] [get_bd_pins vio_adc_freq/probe_in2] [get_bd_pins usp_rf_data_converter_0/adc0_01_nco_freq]
connect_bd_net [get_bd_pins nco_adc_ctrl/nco_freq1] [get_bd_pins vio_adc_freq/probe_in3] [get_bd_pins usp_rf_data_converter_0/adc0_23_nco_freq]
connect_bd_net [get_bd_pins nco_adc_ctrl/nco_req] [get_bd_pins usp_rf_data_converter_0/adc0_nco_update_req]
connect_bd_net [get_bd_pins nco_adc_ctrl/status] [get_bd_pins vio_adc_freq/probe_in0]
connect_bd_net [get_bd_pins nco_dac_ctrl/completed_count] [get_bd_pins vio_dac_freq/probe_in1]
connect_bd_net [get_bd_pins nco_dac_ctrl/nco_en0] [get_bd_pins usp_rf_data_converter_0/dac00_nco_update_en]
connect_bd_net [get_bd_pins nco_dac_ctrl/nco_en1] [get_bd_pins usp_rf_data_converter_0/dac02_nco_update_en]
connect_bd_net [get_bd_pins nco_dac_ctrl/nco_freq0] [get_bd_pins vio_dac_freq/probe_in2] [get_bd_pins usp_rf_data_converter_0/dac00_nco_freq]
connect_bd_net [get_bd_pins nco_dac_ctrl/nco_freq1] [get_bd_pins vio_dac_freq/probe_in3] [get_bd_pins usp_rf_data_converter_0/dac02_nco_freq]
connect_bd_net [get_bd_pins nco_dac_ctrl/nco_req] [get_bd_pins usp_rf_data_converter_0/dac0_nco_update_req]
connect_bd_net [get_bd_pins nco_dac_ctrl/status] [get_bd_pins vio_dac_freq/probe_in0]
connect_bd_net [get_bd_pins rst_ps8_0_100M/peripheral_aresetn] \
  [get_bd_pins axi_quad_spi_0/s_axi_aresetn] [get_bd_pins clk_wiz_adc/resetn] [get_bd_pins clk_wiz_dac/resetn] \
  [get_bd_pins usp_rf_data_converter_0/s_axi_aresetn] [get_bd_pins system_ila_0/resetn] \
  [get_bd_pins axi_interconnect_0/ARESETN] [get_bd_pins axi_interconnect_0/S00_ARESETN] \
  [get_bd_pins axi_interconnect_0/M00_ARESETN] [get_bd_pins axi_interconnect_0/M01_ARESETN] \
  [get_bd_pins axi_interconnect_0/M02_ARESETN] [get_bd_pins nco_adc_ctrl/rst_n] [get_bd_pins nco_dac_ctrl/rst_n]
connect_bd_net [get_bd_ports sys_rstn] [get_bd_pins clk_wiz_0/resetn] [get_bd_pins clk_wiz_1/resetn]
connect_bd_net [get_bd_pins usp_rf_data_converter_0/adc0_nco_update_busy] [get_bd_pins nco_adc_ctrl/nco_busy]
connect_bd_net [get_bd_pins usp_rf_data_converter_0/clk_adc0] [get_bd_pins clk_wiz_adc/clk_in1]
connect_bd_net [get_bd_pins usp_rf_data_converter_0/clk_dac0] [get_bd_pins clk_wiz_dac/clk_in1]
connect_bd_net [get_bd_pins usp_rf_data_converter_0/dac0_nco_update_busy] [get_bd_pins nco_dac_ctrl/nco_busy]
connect_bd_net [get_bd_pins vio_adc_freq/probe_out0] [get_bd_pins nco_adc_ctrl/freq0]
connect_bd_net [get_bd_pins vio_adc_freq/probe_out1] [get_bd_pins nco_adc_ctrl/freq1]
connect_bd_net [get_bd_pins vio_adc_freq/probe_out2] [get_bd_pins nco_adc_ctrl/channel_mask]
connect_bd_net [get_bd_pins vio_adc_freq/probe_out3] [get_bd_pins nco_adc_ctrl/apply_toggle]
connect_bd_net [get_bd_pins vio_dac_freq/probe_out0] [get_bd_pins nco_dac_ctrl/freq0]
connect_bd_net [get_bd_pins vio_dac_freq/probe_out1] [get_bd_pins nco_dac_ctrl/freq1]
connect_bd_net [get_bd_pins vio_dac_freq/probe_out2] [get_bd_pins nco_dac_ctrl/channel_mask]
connect_bd_net [get_bd_pins vio_dac_freq/probe_out3] [get_bd_pins nco_dac_ctrl/apply_toggle]
connect_bd_net [get_bd_pins zynq_ultra_ps_e_0/emio_gpio_o] [get_bd_ports emio_gpio_o]
connect_bd_net [get_bd_pins zynq_ultra_ps_e_0/emio_gpio_t] [get_bd_ports emio_gpio_t]
connect_bd_net [get_bd_pins zynq_ultra_ps_e_0/pl_clk0] [get_bd_pins clk_wiz_1/clk_in1]
connect_bd_net [get_bd_pins zynq_ultra_ps_e_0/pl_resetn0] [get_bd_ports pl_rstn] [get_bd_pins rst_ps8_0_100M/ext_reset_in]
set_property HDL_ATTRIBUTE.DEBUG true [get_bd_intf_nets axi_interconnect_0_M01_AXI]
set_property HDL_ATTRIBUTE.MARK_DEBUG true [get_bd_intf_nets axi_interconnect_0_M01_AXI]

# ---- address map ----
assign_bd_address -offset 0x0080010000 -range 64K -target_address_space [get_bd_addr_spaces zynq_ultra_ps_e_0/Data] [get_bd_addr_segs param_m_axi/Reg]
assign_bd_address -offset 0x0080020000 -range 64K -target_address_space [get_bd_addr_spaces zynq_ultra_ps_e_0/Data] [get_bd_addr_segs axi_quad_spi_0/AXI_LITE/Reg]
assign_bd_address -offset 0x0080040000 -range 256K -target_address_space [get_bd_addr_spaces zynq_ultra_ps_e_0/Data] [get_bd_addr_segs usp_rf_data_converter_0/s_axi/Reg]

validate_bd_design
save_bd_design
